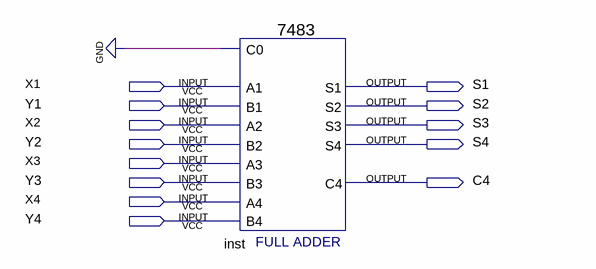
[diagram p0: schematic sheet]
// Quartus schematic 7483_only.bdf as structural Verilog: 1 symbols, 13 pins
module \7483_only  (
  input  X1,
  input  Y1,
  input  X2,
  input  Y2,
  input  X3,
  input  Y3,
  input  X4,
  input  Y4,
  output S1,
  output S2,
  output S3,
  output S4,
  output C4
);

  \7483  inst (
    .B4(Y4), .C0(1'b0), .A1(X1), .A2(X2), .B1(Y1), .B2(Y2), .A3(X3), .B3(Y3), .A4(X4), .S3(S3), .S4(S4),
    .S2(S2), .C4(C4), .S1(S1));
endmodule
